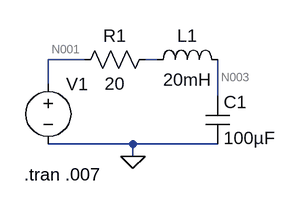
[diagram p0: schematic prob2i.asc]
prob2i.asc, the LTspice schematic file:
Version 4
SHEET 1 880 680
WIRE 80 80 32 80
WIRE 176 80 160 80
WIRE 32 112 32 80
WIRE 256 128 256 80
WIRE 144 192 32 192
WIRE 256 192 144 192
WIRE 144 208 144 192
FLAG 144 208 0
SYMBOL voltage 32 96 R0
WINDOW 123 0 0 Left 2
WINDOW 39 0 0 Left 2
WINDOW 3 24 96 Invisible 2
SYMATTR Value PWL(0 0 .000000001 2 .001000001 2 .001000002 1 .002000002 1 .002000003 -2 .003000003 -2 .003000004 -1 .004000004 -1 .004000005 2 .005000005 2)
SYMATTR InstName V1
SYMBOL cap 240 128 R0
SYMATTR InstName C1
SYMATTR Value 100µF
SYMBOL res 176 64 R90
WINDOW 0 0 56 VBottom 2
WINDOW 3 32 56 VTop 2
SYMATTR InstName R1
SYMATTR Value 20
SYMBOL ind 160 96 R270
WINDOW 0 32 56 VTop 2
WINDOW 3 5 56 VBottom 2
SYMATTR InstName L1
SYMATTR Value 20mH
TEXT 0 232 Left 2 !.tran .007

The netlist it stands for:
* prob2i.asc
V1 N001 0 PWL(0 0 .000000001 2 .001000001 2 .001000002 1 .002000002 1 .002000003 -2 .003000003 -2 .003000004 -1 .004000004 -1 .004000005 2 .005000005 2)
C1 N003 0 100µF
R1 N002 N001 20
L1 N002 N003 20mH
.tran .007
.backanno
.end

* Results of the author's LTspice run, read from the files saved beside the schematic
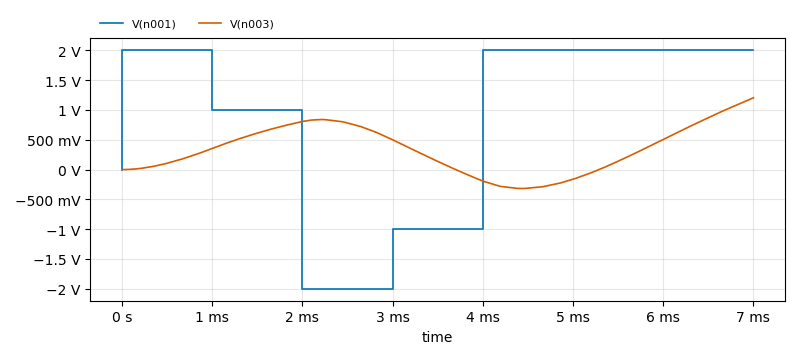
[diagram p1: Transient Analysis of prob2i.asc, plotted from the saved traces]
* Transient Analysis, 1 run:
*   V(n001): min -2 V, max 2 V, average 857.1 mV, rms 1.773 V, last 2 V
*   V(n003): min -317 mV, max 1.204 V, average 337.5 mV, rms 529.7 mV, last 1.204 V